# Altium schematic sheet PositivePwr.SchDoc
size A4; SheetNumber: 3; SheetTotal: 7
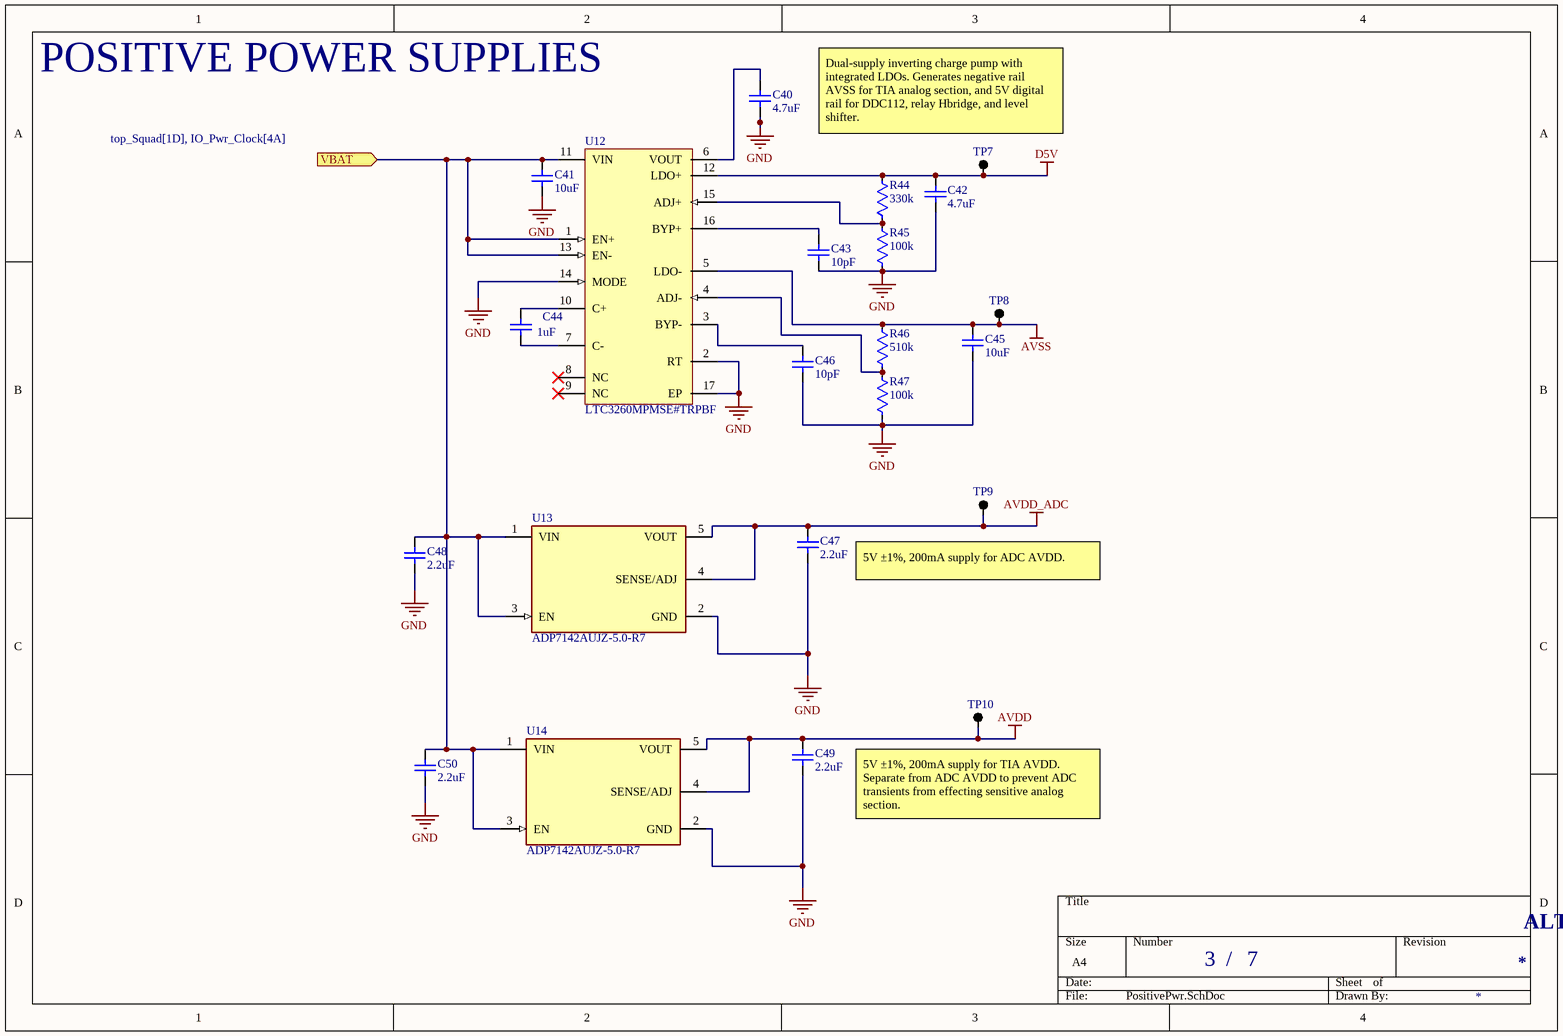
[diagram p0: PositivePwr.SchDoc]

## Parts
C40  4.7uF  [CAP 0805 IPC MID DENSITY]
C41  10uF  [CAP 0805 IPC MID DENSITY]
C42  4.7uF  [CAP 0805 IPC MID DENSITY]
C43  10pF  [CAP 0603 IPC MID DENSITY MURATA]
C44  1uF  [CAP 0805 IPC MID DENSITY]
C45  10uF  [CAP 0805 IPC MID DENSITY]
C46  10pF  [CAP 0603 IPC MID DENSITY MURATA]
C47  2.2uF  [CAP 1206 UNKNOWN]
C48  2.2uF  [CAP 1206 UNKNOWN]
C49  2.2uF  [CAP 1206 UNKNOWN]
C50  2.2uF  [CAP 1206 UNKNOWN]
R44  330k  [RES 0603 IPC MID DENSITY]
R45  100k  [RES 0603 IPC MID DENSITY]
R46  510k  [RES 0603 IPC MID DENSITY]
R47  100k  [RES 0603 IPC MID DENSITY]
TP7  Testpoint  [TESTPOINT THT]  (value not drawn)  (no BOM)
TP8  Testpoint  [TESTPOINT THT]  (value not drawn)  (no BOM)
TP9  Testpoint  [TESTPOINT THT]  (value not drawn)  (no BOM)
TP10  Testpoint  [TESTPOINT THT]  (value not drawn)  (no BOM)
U12  LTC3260MPMSE#TRPBF  [LT-MSE-16-EDP_L]
U13  ADP7142AUJZ-5.0-R7  [SOT23-5 HIGH DENSITY AD]
U14  ADP7142AUJZ-5.0-R7  [SOT23-5 HIGH DENSITY AD]

## Ports
VBAT (in, see top_Squad[1D], IO_Pwr_Clock[4A])

## Nets
AVDD: C49.1 TP10.1 U14.4(SENSE/ADJ) U14.5(VOUT)
AVDD_ADC: C47.1 TP9.1 U13.4(SENSE/ADJ) U13.5(VOUT)
AVSS: C45.2 R46.2 TP8.1 U12.5(LDO-)
D5V: C42.2 R44.2 TP7.1 U12.12(LDO+)
GND: C40.1 C41.1 C42.1 C43.1 C45.1 C46.1 C47.2 C48.2 C49.2 C50.2 R45.1 R47.1 U12.2(RT) U12.14(MODE) U12.17(EP) U13.2(GND) U14.2(GND)
VBAT: C41.2 C48.1 C50.1 U12.1(EN+) U12.11(VIN) U12.13(EN-) U13.1(VIN) U13.3(EN) U14.1(VIN) U14.3(EN) ; port VBAT
NetC40_2: C40.2 U12.6(VOUT)
NetC43_2: C43.2 U12.16(BYP+)
NetC44_1: C44.1 U12.7(C-)
NetC44_2: C44.2 U12.10(C+)
NetC46_2: C46.2 U12.3(BYP-)
NetR44_1: R44.1 R45.2 U12.15(ADJ+)
NetR46_1: R46.1 R47.2 U12.4(ADJ-)

Not connected (* = marked no-connect by the designer): U12 8(NC)* 9(NC)*

## Notes on the sheet
- POSITIVE POWER SUPPLIES
- Dual-supply inverting charge pump with integrated LDOs. Generates negative rail AVSS for TIA analog section, and 5V digital rail for DDC112, relay Hbridge, and level shifter.
- 5V ±1%, 200mA supply for ADC AVDD.
- (near TP10) 5V ±1%, 200mA supply for TIA AVDD. Separate from ADC AVDD to prevent ADC transients from effecting sensitive analog section.
- /
- ALTAIR PhotoDiode ReadOut (PDRO) - Squad

## Library data of the parts
C40-C46 = CAP: Murata GRM21BR61E106KA73L - Cap Ceramic 10uF 10% 25V X5R 0805; MF: Murata; MP: GRM21BR61E106KA73L
C47-C50 = CAP: CL31B225KBHNNNE CAP CER 2.2UF 50V X7R 1206; MF: Samsung Electro-Mechanics; MP: CL31B225KBHNNNE
R44-R47 = RES: Panasonic ERJ-3EKF2001V Res Thick Film 0603 2K Ohm 1% 1/10W ±100ppm/°C; MF: Panasonic Electronic Components; MP: ERJ-3EKF2001V
U12 = CMP-0475-00262-1: Low Noise Dual Supply Inverting Charge Pump, 4.5 to 32 V Vin, Adjustable Vout, 16-pin SOP (MSE-16-EDP), -50 to 150 degC, Pb-Free, Tape and Reel; Manufacturer: Linear Technology; Voutput: Adj; Isupply(mA): 0.1; Vin Max(V): 32; Frequency(kHz): 500; Max Iout(mA): 100; Ishutdown(uA): 2; Vin Min(V): 4.5; RoHS: TRUE; ComponentLink1URL: http://www.linear.com/; Packing: Tape and Reel; ComponentLink3Description: Package Specification; ComponentLink3URL: http://cds.linear.com/docs/en/packaging/05081667_F_MSE16.pdf; Mounting Technology: Surface Mount; PackageReference: MSE-16; PackageDescription: 16-Pin Plastic MSOP, Exposed Die Pad, Body 4.039 x 3 mm, Pitch 0.5 mm; ComponentLink1Description: Manufacturer URL; ComponentLink2URL: http://cds.linear.com/docs/en/datasheet/3260fa.pdf; PartNumber: LTC3260MPMSE#TRPBF; PackageVersion: Rev. F, 05/2013; ComponentLink2Description: Datasheet; DatasheetVersion: Rev. A
U13 U14 = ADP7142AUJZ-R7: 1.2-40V 200mA Low Noise CMOS LDO Adjustable Linear Regulator TSOT23; Nominal Supply Current: 50-180uA; Output Type: AdjustableProgrammable; Max Supply Voltage: 40V; Number Of Outputs: 1; Dropout Voltage: 200mV; Output Voltage: 1.2-5V; Min Supply Voltage: 2.7V; Max Junction Temp: +150°C; MF: Analog Devices; Accuracy Percentage: 0.8%; Ambient Temperature Range Low: -40°C; ComponentLink2Description: Datasheet; Digikey Description: IC REG LIN POS ADJ 200MA TSOT23; Device Class L1: Integrated Circuits (ICs); Mouser Description: LDO Regulator Pos 1.5V to 5V 0.2A 5-Pin TSOT-23 T/R; Height: 1mm; Temperature Range Low: -40°C; Output Current: 200mA; Device Class L3: Voltage Regulators - Linear; Octopart: https://octopart.com/adp7142aujz-r7-analog+devices-38928114; Category: IC; MP: ADP7142AUJZ-5.0-R7; ComponentLink2URL: https://www.analog.com/media/en/technical-documentation/data-sheets/ADP7142.pdf; Device Class L2: Power Management ICs; Package: UJ-5; Automotive: No; Lead Free: Yes; Ambient Temperature Range High: +125°C; Temperature: -40°C to +125°C; Temperature Range High: +125°C; RoHS: TRUE; Manufacturer: Analog Devices; Manufacturer Part Number: ADP7142AUJZ-R7